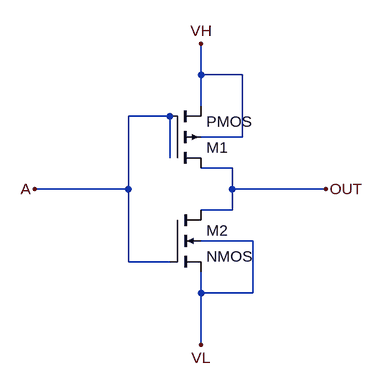
[diagram p0: schematic NOT4.asc]
NOT4.asc, the LTspice schematic file:
Version 4
SHEET 1 880 680
WIRE 384 -32 384 -80
WIRE 448 -32 384 -32
WIRE 384 16 384 -32
WIRE 336 32 272 32
WIRE 448 64 448 -32
WIRE 448 64 384 64
WIRE 336 96 336 32
WIRE 432 112 384 112
WIRE 272 144 272 32
WIRE 272 144 128 144
WIRE 432 144 432 112
WIRE 576 144 432 144
WIRE 432 176 432 144
WIRE 432 176 384 176
WIRE 464 224 384 224
WIRE 272 256 272 144
WIRE 336 256 272 256
WIRE 384 304 384 272
WIRE 464 304 464 224
WIRE 464 304 384 304
WIRE 384 384 384 304
FLAG 576 144 OUT
FLAG 384 384 VL
FLAG 384 -80 VH
FLAG 128 144 A
SYMBOL pmos4 336 112 M180
SYMATTR InstName M1
SYMBOL nmos4 336 176 R0
SYMATTR InstName M2

The netlist it stands for:
* NOT4.asc
M1 OUT A VH VH PMOS
M2 OUT A VL VL NMOS
.model NMOS NMOS
.model PMOS PMOS
.lib standard.mos
.backanno
.end